# EAGLE design XBEE_USB (EAGLE 5.07)
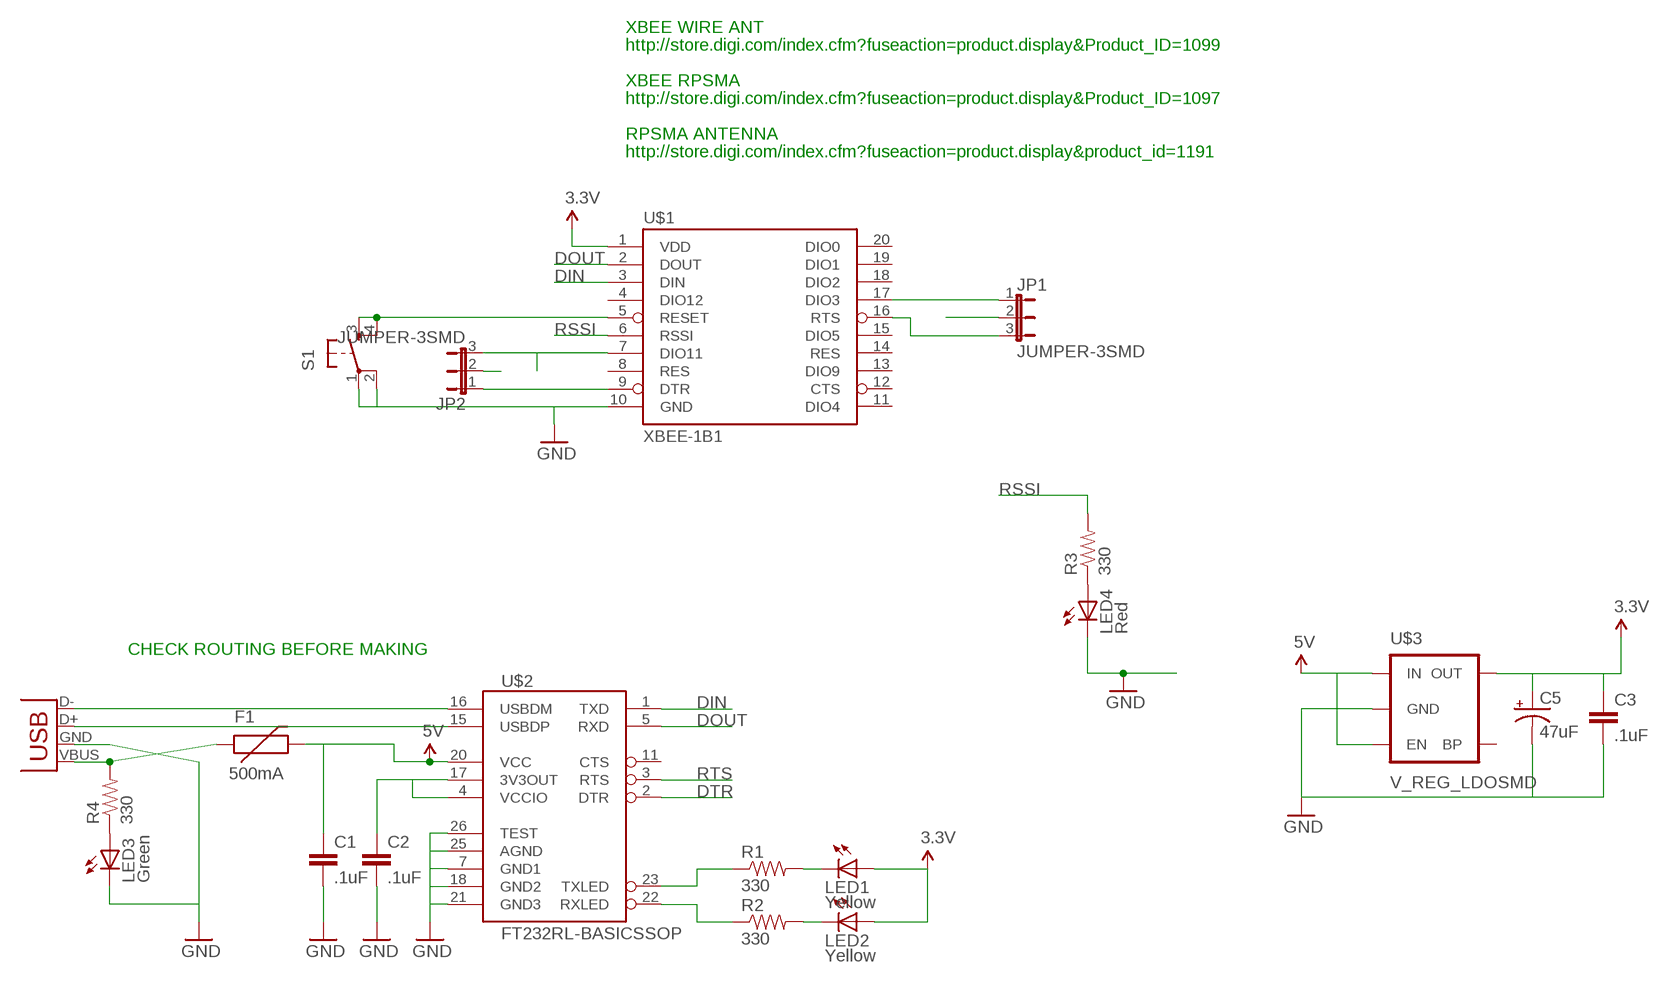
[diagram p0: schematic, sheet 1]

## Parts
C1  .1uF  CAP0805  [0805]
C2  .1uF  CAP0805  [0805]
C3  .1uF  CAP0805  [0805]
C5  47uF  CAP_POL3528  [EIA3528]
F1  500mA  PTCSMD  [PTC-1206]
JP1  JUMPER-3SMD  [SJ_3]
JP2  JUMPER-3SMD  [SJ_3]
LED1  Yellow  LEDCHIP-LED0805  [CHIP-LED0805]
LED2  Yellow  LEDCHIP-LED0805  [CHIP-LED0805]
LED3  Green  LEDCHIP-LED0805  [CHIP-LED0805]
LED4  Red  LEDCHIP-LED0805  [CHIP-LED0805]
R1  330  RESISTOR  [0805]
R2  330  RESISTOR  [0805]
R3  330  RESISTOR  [0805]
R4  330  RESISTOR  [0805]
S1  TAC_SWITCHSMD  [TACTILE_SWITCH_SMD]
U$1  XBEE-1B1  [XBEE-1]
U$2  FT232RL-BASICSSOP  [SSOP28DB]
U$3  V_REG_LDOSMD  [SOT23-5]
X3  USB-A-H  [USB-A-H]

## Nets
3.3V: C3.1 C5.A(+) LED1.A LED2.A U$1.1(VDD) U$3.5(OUT)
5V: C1.1 F1.2 U$2.20(VCC) U$3.1(IN) U$3.3(EN)
DIN: U$1.3(DIN) U$2.1(TXD)
DOUT: U$1.2(DOUT) U$2.5(RXD)
DTR: JP2.2 U$2.2(DTR)
GND: C1.2 C2.2 C3.2 C5.C(-) LED3.C LED4.C S1.1 S1.2 U$1.10(GND) U$2.7(GND1) U$2.18(GND2) U$2.21(GND3) U$2.25(AGND) U$2.26(TEST) U$3.2(GND) X3.GND(VBUS)
N$1: U$2.16(USBDM) X3.D-(D+)
N$2: U$2.15(USBDP) X3.D+(D-)
N$3: F1.1 R4.2 X3.VBUS(GND)
N$4: LED4.A R3.1
N$5: LED3.A R4.1
N$6: C2.1 U$2.4(VCCIO) U$2.17(3V3OUT)
N$7: S1.3 S1.4 U$1.5(RESET)
N$8: LED1.C R1.2
N$9: LED2.C R2.2
N$10: JP2.3 U$1.7(DIO11)
N$11: JP2.1 U$1.9(DTR)
N$12: R1.1 U$2.23(TXLED)
N$13: R2.1 U$2.22(RXLED)
N$14: JP1.1 U$1.17(DIO3)
N$15: JP1.3 U$1.16(RTS)
RSSI: R3.2 U$1.6(RSSI)
RTS: JP1.2 U$2.3(RTS)
Unconnected: U$1.4(DIO12) U$1.8(RES) U$1.11(DIO4) U$1.12(CTS) U$1.13(DIO9) U$1.14(RES) U$1.15(DIO5) U$1.18(DIO2) U$1.19(DIO1) U$1.20(DIO0) U$2.11(CTS) U$3.4(BP)

## Notes on the sheet
- XBEE WIRE ANT
- http://store.digi.com/index.cfm?fuseaction=product.display&Product_ID=1099
- XBEE RPSMA
- http://store.digi.com/index.cfm?fuseaction=product.display&Product_ID=1097
- RPSMA ANTENNA
- http://store.digi.com/index.cfm?fuseaction=product.display&product_id=1191
- CHECK ROUTING BEFORE MAKING

## Library data of the parts
C1-C3 = SparkFun:CAP: Capacitor Standard 0603 ceramic capacitor, and 0.1" leaded capacitor.
C5 = SparkFun:CAP_POL: Capacitor Polarized These are standard SMD and PTH capacitors. Normally 10uF, 47uF, and 100uF in electrolytic and tantalum varieties. Always verify the external diameter of the through hole cap, it varies with capacity, voltage, and manufacturer. The EIA devices should be standard.
F1 = SparkFun:PTC: Resettable Fuse PTC Resettable Fuse. Spark Fun Electronics SKU : COM-08357
JP1 JP2 = SparkFun:JUMPER-3
LED1-LED4 = led:LED: LED OSRAM: - CHIPLED LG R971, LG N971, LY N971, LG Q971, LY Q971, LO R971, LY R971 LH N974, LH R974 LS Q976, LO Q976, LY Q976 LO Q996 - Hyper CHIPLED LW Q18S LB Q993, LB Q99A, LB R99A - SideLED LS A670, LO A670, LY A670, LG A670, LP A670 LB A673, LV A673, LT A673, LW A673 LH A674 LY A675 LS A676, LA A676, LO A676, LY A676, LW A676 LS A679, LY A679, LG A679 - Hyper Micro SIDELED® LS Y876, LA Y876, LO Y876, LY Y876 LT Y87S - SmartLED LW L88C, LW L88S LB L89C, LB L89S, LG L890 LS L89K, LO L89K, LY L89K LS L896, LA L896, LO L896, LY L896 - TOPLED LS T670, LO T670, LY T670, LG T670, LP T670 LSG T670, LSP T670, LSY T670, LOP T670, LYG T670 LG T671, LOG T671, LSG T671 LB T673, LV T673, LT T673, LW T673 LH T674 LS T676, LA T676, LO T676, LY T676, LB T676, LH T676, LSB T676, LW T676 LB T67C, LV T67C, LT T67C, LS T67K, LO T67K, LY T67K, LW E67C LS E67B, LA E67B, LO E67B, LY E67B, LB E67C, LV E67C, LT E67C LW T67C LS T679, LY T679, LG T679 LS T770, LO T770, LY T770, LG T770, LP T770 LB T773, LV T773, LT T773, LW T773 LH T774 LS E675, LA E675, LY E675, LS T675 LS T776, LA T776, LO T776, LY T776, LB T776 LHGB T686 LT T68C, LB T68C - Hyper Mini TOPLED® LB M676 - Mini TOPLED Santana® LG M470 LS M47K, LO M47K, LY M47K Source: http://www.osram.convergy.de LUXEON: - LUMILED® LXK2-PW12-R00, LXK2-PW12-S00, LXK2-PW14-U00, LXK2-PW14-V00 LXK2-PM12-R00, LXK2-PM12-S00, LXK2-PM14-U00 LXK2-PE12-Q00, LXK2-PE12-R00, LXK2-PE12-S00, LXK2-PE14-T00, LXK2-PE14-U00 LXK2-PB12-K00, LXK2-PB12-L00, LXK2-PB12-M00, LXK2-PB14-N00, LXK2-PB14-P00, LXK2-PB14-Q00 LXK2-PR12-L00, LXK2-PR12-M00, LXK2-PR14-Q00, LXK2-PR14-R00 LXK2-PD12-Q00, LXK2-PD12-R00, LXK2-PD12-S00 LXK2-PH12-R00, LXK2-PH12-S00 LXK2-PL12-P00, LXK2-PL12-Q00, LXK2-PL12-R00 Source: www.luxeon.com KINGBRIGHT: KA-3528ASYC Source: www.kingbright.com
R1-R4 = SparkFun:RESISTOR: Resistor Basic schematic elements and footprints for 0603, 1206, and PTH 1/10th watt (small) resistors.
S1 = SparkFun:TAC_SWITCH: Momentary Switch Button commonly used for reset or general input. Spark Fun Electronics SKU : COM-00097
U$1 = SparkFun:XBEE-1
U$2 = SparkFun:FT232RL-BASIC: USB UART This is the simplified version of the FT232RL unit. Only what you need, nothing you don't. Spark Fun Electronics SKU : COM-00650
U$3 = SparkFun:V_REG_LDO: Voltage Regulator LDO Standard 150mA LDO voltage regulator in SOT-23 layout. Micrel part MIC5205. BP (by-pass) pin is used to lower output noise with 470pF cap.
X3 = SparkFun:USB: USB Connectors USB-B-PTH is fully proven SKU : PRT-00139 USB-miniB is fully proven SKU : PRT-00587 USB-A-PCB is untested. USB-A-H is throughly reviewed, but untested. Spark Fun Electronics SKU : PRT-00437 USB-B-SMT is throughly reviewed, but untested. Needs silkscreen touching up. USB-A-S has not been used/tested USB-MB-H has not been used/tested

## Board
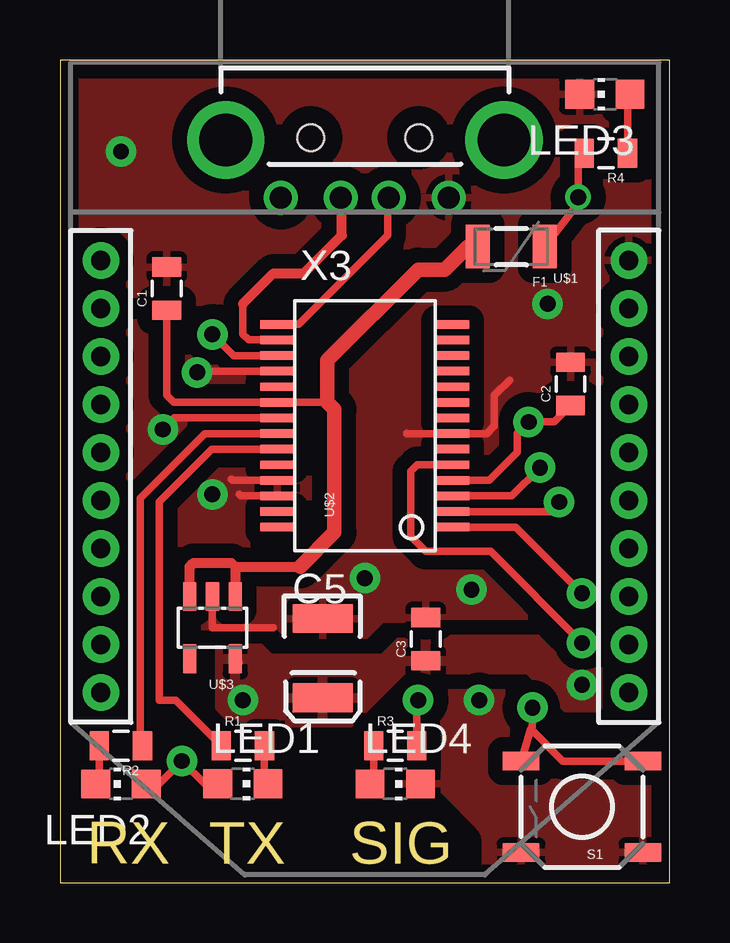
[diagram p1: board, top side]
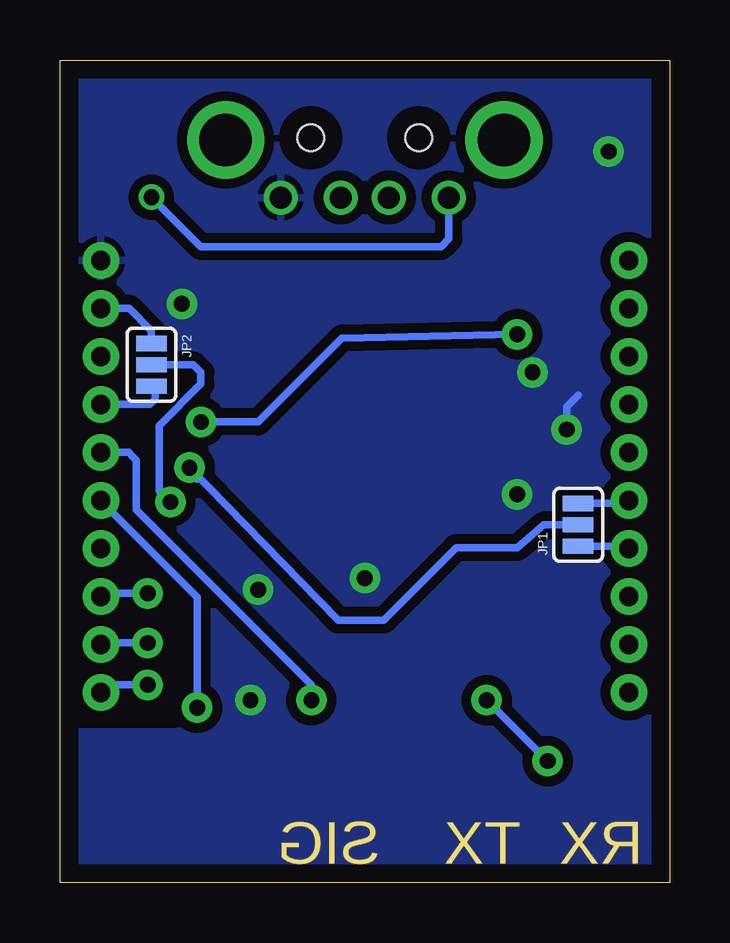
[diagram p2: board, bottom side, seen from below]

Size 25.4 x 34.29 mm. Coordinates in mm from the lower left corner, seen from the top.
Outline: 0,0 25.4,0 25.4,34.29 0,34.29 0,0
Copper layers (1*16): Top 0.035mm / dielectric 1.5mm / Bottom 0.035mm
Design rules "default *": minimum track width 12mil, minimum drill 24mil, track to track 12mil, track to pad 12mil, pad to pad 11mil, via to via 12mil, smd to smd 8mil, copper to edge 30mil, drill to drill 8mil, minimum pad ring 10mil, minimum via ring 8mil, stop-mask expansion 4mil, vias tented up to drill 0mil, thermal gap 10mil
tRestrict: 3 lines
bRestrict: 2 lines

### Footprints (pad centres in the part's own frame; a part is rotated, then mirrored left to right if it is on the bottom)
0805 = smd 0.8 x 1.2: 1 -0.9,0; 2 0.9,0
EIA3528 = smd 1.2 x 2.5: A 1.65,0; C -1.65,0
PTC-1206 = smd 1 x 1.8: 1 -1.4,0; 2 1.4,0
SJ_3 = smd 0.635 x 1.27: 1 -0.889,0; 2 0,0; 3 0.889,0
CHIP-LED0805 = smd 1.2 x 1.2: A 0,-1.05; C 0,1.05
TACTILE_SWITCH_SMD = smd 1.524 x 0.762: 1 -2.54,1.905; 2 2.54,1.905; 3 -2.54,-1.905; 4 2.54,-1.905
XBEE-1 = drill 0.8 pad 1.524 round: 1 -11,20; 2 -11,18; 3 -11,16; 4 -11,14; 5 -11,12; 6 -11,10; 7 -11,8; 8 -11,6; 9 -11,4; 10 -11,2; 11 11,2; 12 11,4; 13 11,6; 14 11,8; 15 11,10; 16 11,12; 17 11,14; 18 11,16; 19 11,18; 20 11,20
SSOP28DB = smd 0.348 x 1.397: 1 -4.225,-3.656; 2 -3.575,-3.656; 3 -2.925,-3.656; 4 -2.275,-3.656; 5 -1.625,-3.656; 6 -0.975,-3.656; 7 -0.325,-3.656; 8 0.325,-3.656; 9 0.975,-3.656; 10 1.625,-3.656; 11 2.275,-3.656; 12 2.925,-3.656; 13 3.575,-3.656; 14 4.225,-3.656; 15 4.225,3.656; 16 3.575,3.656; 17 2.925,3.656; 18 2.275,3.656; 19 1.625,3.656; 20 0.975,3.656; 21 0.325,3.656; 22 -0.325,3.656; 23 -0.975,3.656; 24 -1.625,3.656; 25 -2.275,3.656; 26 -2.925,3.656; 27 -3.575,3.656; 28 -4.225,3.656
SOT23-5 = smd 0.55 x 1.2: 1 -0.95,-1.3; 2 0,-1.3; 3 0.95,-1.3; 4 0.95,1.3; 5 -0.95,1.3
USB-A-H = drill 0.914 round: D+ 2.4,1; D- 2.4,-1; GND 2.4,3.5; VBUS 2.4,-3.5 | drill 2.2 round: GND@1 0,5.8; GND@2 0,-5.8 | hole 1.1: -0.1,2.25; -0.1,-2.25

### Placement (x,y rotation side)
C1  4.45,24.77 90 top
C2  21.27,20.8 90 top
C3  15.24,10.16 90 top
C5  10.95,9.37 270 top
F1  18.8,26.52 180 top
JP1  3.81,14.92 90 bottom
JP2  21.59,21.59 270 bottom
LED1  7.62,4.13 270 top
LED2  2.54,4.13 90 top
LED3  22.7,32.86 90 top
LED4  13.97,4.13 270 top
R1  7.62,5.71 0 top
R2  2.54,5.71 180 top
R3  13.97,5.72 0 top
R4  22.75,30.41 180 top
S1  21.75,3.17 180 top
U$1  12.7,27.94 180 top
U$2  12.7,19.05 90 top
U$3  6.35,10.64 180 top
X3  12.7,30.96 270 top

### Tracks (layer width: path | path; a pad name or v marks a point on that pad's centre or on a via)
3.3V  (via drill 0.66 pad 1.27)
  Top 0.305: U$3.5 7.46,9.18 | LED1.A 6.03,4.13 v5.08,5.08 4.13,4.13 LED2.A
  Bottom 0.305: v21.75,8.26 23.39,8.26 U$1.1 | v5.08,5.08 v7.62,7.62
  pour Top (isolate 0.508, rank 2): 6.67,9.84 8.26,9.84 8.73,9.37 13.49,9.37 14.29,10.16 19.84,10.16 20.8,9.21 22.38,9.21 22.38,7.3 21.11,7.3 19.53,8.89 14.29,8.89 12.06,6.67 7.3,6.67 6.67,7.3
5V
  Top 0.305: C1.1 4.45,20.32 4.74,20.02 U$2.20 11.13,20.02 | F1.2
  Top 0.406: 7.3,13.18 10,13.18 | 7.3,13.18 7.14,13.34 5.56,13.34 5.4,13.18 U$3.3 | 7.3,13.18 U$3.1
  Top 0.61: F1.2 16.99,26.51 16.03,25.56 14.92,25.56 11.13,21.77 11.13,20.02 11.43,19.73 11.43,14.61 10,13.18
DIN  (via drill 0.66 pad 1.27)
  Top 0.305: U$2.1 18.99,14.82 v21.75,12.06
  Bottom 0.305: v21.75,12.06 23.57,12.06 U$1.3
DOUT  (via drill 0.66 pad 1.27)
  Top 0.305: U$2.5 14.88,17.43 14.61,17.14 14.61,14.45 15.24,13.81 17.94,13.81 v21.75,10
  Bottom 0.305: U$1.2 23.64,10 21.59,10 21.51,10.08 v21.75,10
DTR  (via drill 0.66 pad 1.27)
  Top 0.305: U$2.2 20.4,15.47 v20.8,15.88
  Bottom 0.305: v20.8,15.88 21.27,16.35 21.27,19.05 19.53,20.8 19.53,21.27 19.84,21.59 JP2.2
GND  (via drill 0.66 pad 1.27)
  Top 0.305: U$2.18 5.98,21.32 v5.71,21.27 | U$2.25 7.2,16.77 7.14,16.83 | U$2.26 7.53,16.12 7.46,16.19 | U$3.2 6.35,10.64 8.89,10.64 | U$2.21 4.77,19.38 v4.29,18.89 | 18.73,20.95 18.1,20.32 18.1,19.05 17.77,18.73 16.04,18.73 16.03,18.73 | U$2.7 14.45,18.73
  Bottom 0.305: v4.29,18.89 4.29,19.84 3.81,20.32
  other vias: 2.54,30.48 20.32,24.13 17.46,7.62 12.7,12.7 6.35,16.19 17.14,12.22
  pour Top (isolate 0.61, rank 6): 0,34.29 25.4,34.29 25.4,0 0,0
  pour Bottom (isolate 0.406, rank 6): 0,34.29 25.4,34.29 25.4,0 0,0
N$1
  Top 0.305: 11.75,28.6 X3.D- | U$2.16 7.86,22.62 7.62,22.86 7.62,24.13
  Top 0.406: 11.75,28.6 11.75,26.99 10.16,25.4 8.89,25.4 7.62,24.13
N$2
  Top 0.305: X3.D+ 13.65,27.97 13.65,26.99 9.94,23.27 U$2.15
N$3  (via drill 0.66)
  Top 0.305: R4.2 21.59,30.31 v21.59,28.57 21.59,28.33 F1.1
  Bottom 0.305: v21.59,28.57 19.53,26.51 9.53,26.51 9.2,26.84 X3.VBUS
N$4
  Top 0.305: R3.1 13.07,4.28 LED4.A
N$5
  Top 0.305: R4.1 23.65,33.08 LED3.A
N$6  (via drill 0.66 pad 1.27)
  Top 0.305: U$2.17 7.24,21.98 v6.35,22.86 | U$2.4 17.89,16.77 19.05,17.94 19.05,18.73 v19.53,19.21 20.59,19.21 C2.1
  Bottom 0.305: v6.35,22.86 13.65,22.7 17.14,19.21 v19.53,19.21
N$7  (via drill 0.66 pad 1.27)
  Top 0.305: v19.68,7.3 19.68,6.51 19.61,6.43 | S1.4 19.61,6.43 | S1.3 20.95,5.08 19.61,6.43
  Bottom 0.305: U$1.5 23.7,15.92 22.07,14.29 | 22.07,14.29 | 22.07,14.29 19.68,11.91 v19.68,7.3
N$8
  Top 0.305: R1.2 8.52,4.28 LED1.C
N$9
  Top 0.305: R2.2 1.64,4.28 LED2.C
N$10
  Bottom 0.305: U$1.7 21.65,19.94 21.43,20.16 21.43,20.54 JP2.3
  Bottom 0.406: U$1.7 23.7,19.84
N$11
  Bottom 0.305: U$1.9 22.51,23.94 21.59,23.02 JP2.1
N$12
  Top 0.305: U$2.23 6.33,18.07 4.13,15.88 4.13,7.62 4.82,7.62 R1.1
N$13
  Top 0.305: U$2.22 6.03,18.73 3.33,16.03 3.33,5.82 R2.1
N$14
  Bottom 0.305: JP1.1 2.11,14.03 U$1.17
N$15
  Bottom 0.305: JP1.3 1.89,15.81 U$1.16
RSSI  (via drill 0.66 pad 1.27)
  Top 0.305: R3.2 14.87,7.57 v14.92,7.62
  Bottom 0.305: U$1.6 22.54,17.94 22.38,17.78 | 22.38,17.78 | 22.38,17.78 22.23,17.62 22.23,15.56 14.92,8.26 v14.92,7.62
RTS  (via drill 0.66 pad 1.27)
  Top 0.305: U$2.3 18.82,16.12 v20,17.3
  Bottom 0.305: 19.68,16.83 v20,17.3 13.81,10.95 11.91,10.95 8.89,13.97 6.35,13.97 5.24,14.92 JP1.2

### Text on the board
Milling: RX | TX | SIG